# Altium schematic sheet 转接板.SchDoc
size A4
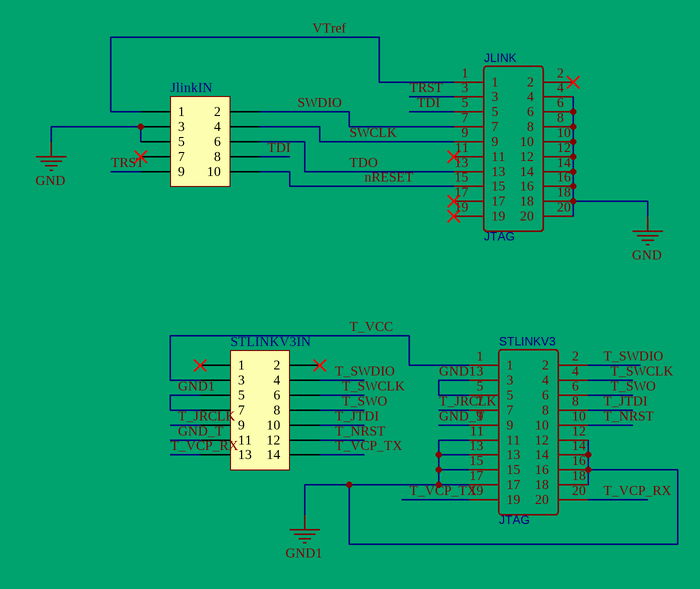
[diagram p0: 转接板.SchDoc]

## Parts
JLINK  JTAG  [IDC-TH_20P-P2.54-V-R2-C10-S2.54]
JlinkIN  Header 5X2  [HDR-SMD_10P-P1.27-V-R2-C5-S5.00]  (value not drawn)
STLINKV3  JTAG  [IDC-TH_20P-P2.54-V-R2-C10-S2.54]
STLINKV3IN  Header 7X2  [STDC14(SOIC)]  (value not drawn)

## Nets
GND: JLINK.4 JLINK.6 JLINK.8 JLINK.10 JLINK.12 JLINK.14 JLINK.16 JLINK.18 JLINK.20 JlinkIN.3 JlinkIN.5
GND1: STLINKV3.3 STLINKV3.5 STLINKV3.11 STLINKV3.12 STLINKV3.13 STLINKV3.14 STLINKV3.15 STLINKV3.16 STLINKV3.17 STLINKV3.18 STLINKV3IN.5 STLINKV3IN.7
GND_T: STLINKV3.9 STLINKV3IN.11
nRESET: JLINK.15 JlinkIN.10
SWCLK: JLINK.9 JlinkIN.4
SWDIO: JLINK.7 JlinkIN.2
T_JRCLK: STLINKV3.7 STLINKV3IN.9
T_JTDI: STLINKV3.8 STLINKV3IN.10
T_NRST: STLINKV3.10 STLINKV3IN.12
T_SWCLK: STLINKV3.4 STLINKV3IN.6
T_SWDIO: STLINKV3.2 STLINKV3IN.4
T_SWO: STLINKV3.6 STLINKV3IN.8
T_VCC: STLINKV3.1 STLINKV3IN.3
T_VCP_RX: STLINKV3.20 STLINKV3IN.13
T_VCP_TX: STLINKV3.19 STLINKV3IN.14
TDI: JLINK.5 JlinkIN.8
TDO: JLINK.13 JlinkIN.6
TRST: JLINK.3 JlinkIN.9
VTref: JLINK.1 JlinkIN.1

Not connected (* = marked no-connect by the designer): JLINK 2* 11* 17* 19*; JlinkIN 7*; STLINKV3IN 1* 2*

## Library data of the parts
JLINK STLINKV3 = JTAG: BOM_Manufacturer: Nextronics Engineering; BOM_Manufacturer Part: Z-231011020106; Contributor: LCSC; BOM_Supplier: LCSC; BOM_Supplier Part: C221051; spicePre: C; spiceSymbolName: Z-231011020106
JlinkIN = Header 5X2: Header, 5-Pin, Dual row; LatestRevisionDate: 17-Jul-2002; LatestRevisionNote: Re-released for DXP Platform.; Publisher: Altium Limited
STLINKV3IN = Header 7X2: Header, 7-Pin, Dual row; LatestRevisionDate: 17-Jul-2002; LatestRevisionNote: Re-released for DXP Platform.; Publisher: Altium Limited